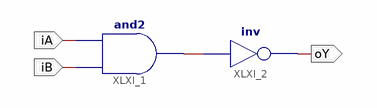
[diagram p0: schematic sheet 1]
// Xilinx ISE schematic MyFirstDigitalSystem.sch (spartan6) as structural Verilog: 2 symbols, 3 ports
module MyFirstDigitalSystem (
  input  iA,
  input  iB,
  output oY
);

  wire XLXN_1;

  and XLXI_1 (XLXN_1, iB, iA);
  not XLXI_2 (oY, XLXN_1);
endmodule
